# EAGLE design ina226-breakout (EAGLE 9.6.2)
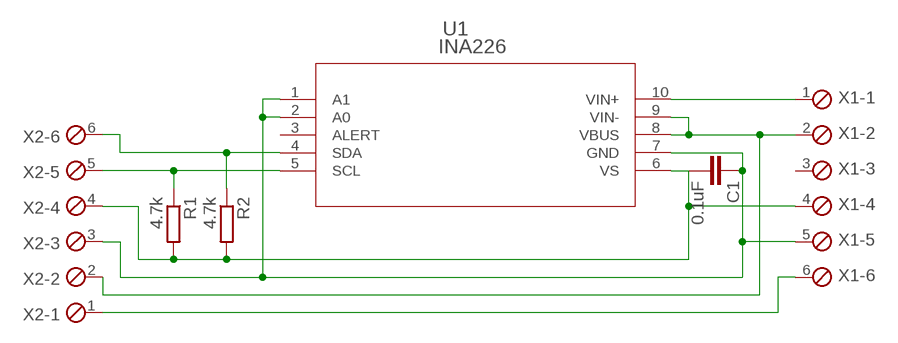
[diagram p0: schematic, sheet 1]

## Parts
C1  0.1uF  C-EUC0603  [C0603]
R1  4.7k  R-EU_R0603  [R0603]
R2  4.7k  R-EU_R0603  [R0603]
U1  INA226  INA226AIDGSR  [DGS10]
X1  MPT6  [6POL254]
X2  MPT6  [6POL254]

## Nets
1-WIRE: X1.6 X2.1
GND: C1.1 U1.1(A1) U1.2(A0) U1.7(GND) X1.5 X2.3
SCL: R1.1 U1.5(SCL) X2.5
SDA: R2.1 U1.4(SDA) X2.6
VIN+: U1.10(VIN+) X1.1
VIN-: U1.8(VBUS) U1.9(VIN-) X1.2 X2.2
VS: C1.2 R1.2 R2.2 U1.6(VS) X1.4 X2.4
Unconnected: U1.3(ALERT) X1.3

## Library data of the parts
C1 = rcl:C-EU: CAPACITOR, European symbol; SPICEPREFIX: C
R1 R2 = rcl:R-EU_: RESISTOR, European symbol; SPICEPREFIX: R
U1 = ina226:INA226AIDGSR; COPYRIGHT: Copyright (C) 2022 Ultra Librarian. All rights reserved.; MANUFACTURER_PART_NUMBER: INA226; MFR_NAME: Texas Instruments
X1 X2 = con-phoenix-254:MPT6: PHOENIX CONNECTOR; OC_FARNELL: unknown; OC_NEWARK: unknown

## Board
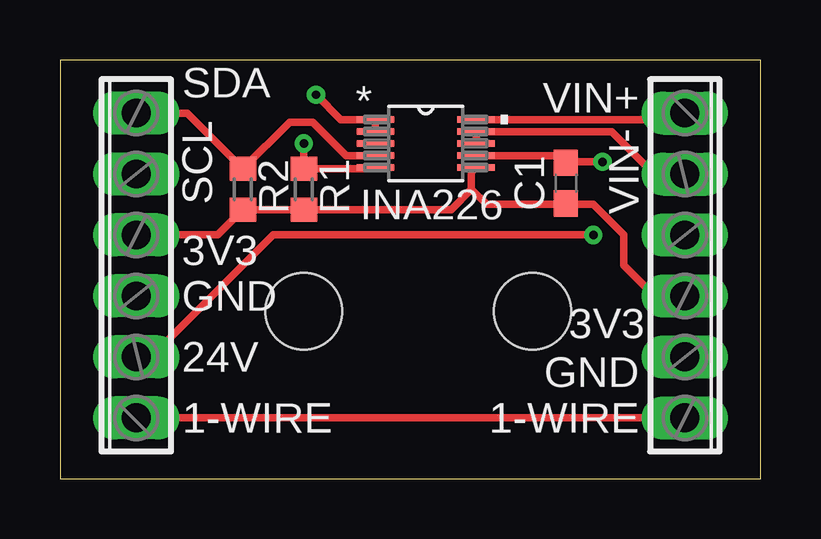
[diagram p1: board, top side]
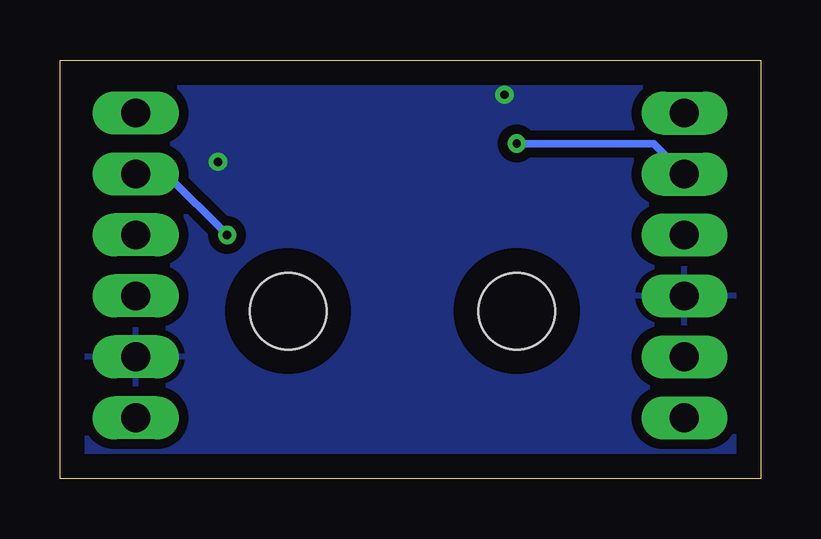
[diagram p2: board, bottom side, seen from below]

Size 29.19 x 17.45 mm. Coordinates in mm from the lower left corner, seen from the top.
Outline: 0,0 29.19,0 29.19,17.45 0,17.45 0,0
Copper layers (1*16): Top 0.035mm / dielectric 1.5mm / Bottom 0.035mm
Design rules "default": minimum track width 6mil, minimum drill 0.35mm, track to track 6mil, track to pad 6mil, pad to pad 6mil, via to via 6mil, smd to smd 6mil, copper to edge 40mil, drill to drill 6mil, minimum pad ring 10mil, minimum via ring 8mil, stop-mask expansion 4mil, vias tented up to drill 0mil, thermal gap 10mil
Holes 3.2 mm at 10.16,6.98 19.68,6.98

### Footprints (pad centres in the part's own frame; a part is rotated, then mirrored left to right if it is on the bottom)
C0603 = smd 1.1 x 1: 1 -0.85,0; 2 0.85,0
R0603 = smd 1 x 1.1: 1 -0.85,0; 2 0.85,0
DGS10 = smd 1.575 x 0.279: 1 -2.095,1; 2 -2.095,0.5; 3 -2.095,0; 4 -2.095,-0.5; 5 -2.095,-1; 6 2.095,-1; 7 2.095,-0.5; 8 2.095,0; 9 2.095,0.5; 10 2.095,1
6POL254 = drill 1.2 pad 1.778 long: 1 -6.35,0; 2 -3.81,0; 3 -1.27,0; 4 1.27,0; 5 3.81,0; 6 6.35,0

### Placement (x,y rotation side)
C1  21.08,12.32 270 top
R1  10.16,12.07 270 top
R2  7.62,12.07 270 top
U1  15.24,13.97 0 top
X1  26.04,8.89 270 top
X2  3.17,8.89 90 top

### Tracks (layer width: path | path; a pad name or v marks a point on that pad's centre or on a via)
1-WIRE
  Top 0.305: X2.1 X1.6
GND  (via drill 0.35)
  Top 0.305: v10.67,16 11.7,14.97 U1.1 U1.2 | v22.61,13.21 21.12,13.21 C1.1 20.78,13.47 U1.7
  pour Bottom (isolate 0.406): -0.64,18.41 -0.64,-0.63 29.84,-0.63 29.84,18.41
SCL  (via drill 0.35)
  Top 0.305: v10.16,13.97 R1.1 13.09,12.91 U1.5
  Bottom 0.305: X2.5 4.45,13.97 v10.16,13.97
SDA
  Top 0.305: X2.6 5.29,15.24 R2.1 9.56,14.86 10.54,14.86 11.93,13.47 U1.4
VIN+
  Top 0.305: U1.10 25.76,14.97 X1.1
VIN-  (via drill 0.35)
  Top 0.305: U1.8 U1.9 22.99,14.47 24.76,12.7 X1.2 | X2.2 3.81,5.08 8.89,10.16 v22.22,10.16
  Bottom 0.305: v22.22,10.16 24.76,12.7 X1.2
VS
  Top 0.305: C1.2 21.08,11.43 | U1.6 17.14,12.78 17.14,12.07 | 17.14,12.07 16.29,11.21 R1.2 R2.2 6.57,10.16 X2.4 | 17.14,12.07 17.78,11.43 21.08,11.43 | X1.4 24.76,7.62 23.49,8.89 23.49,10.16 22.22,11.43 21.08,11.43

### Text on the board
tPlace: SDA | VIN+ | VIN- | SCL | 3V3 | GND | 3V3 | GND | 24V | 1-WIRE | 1-WIRE